# EAGLE design marklin 8-port bus connector (EAGLE 9.5.2)
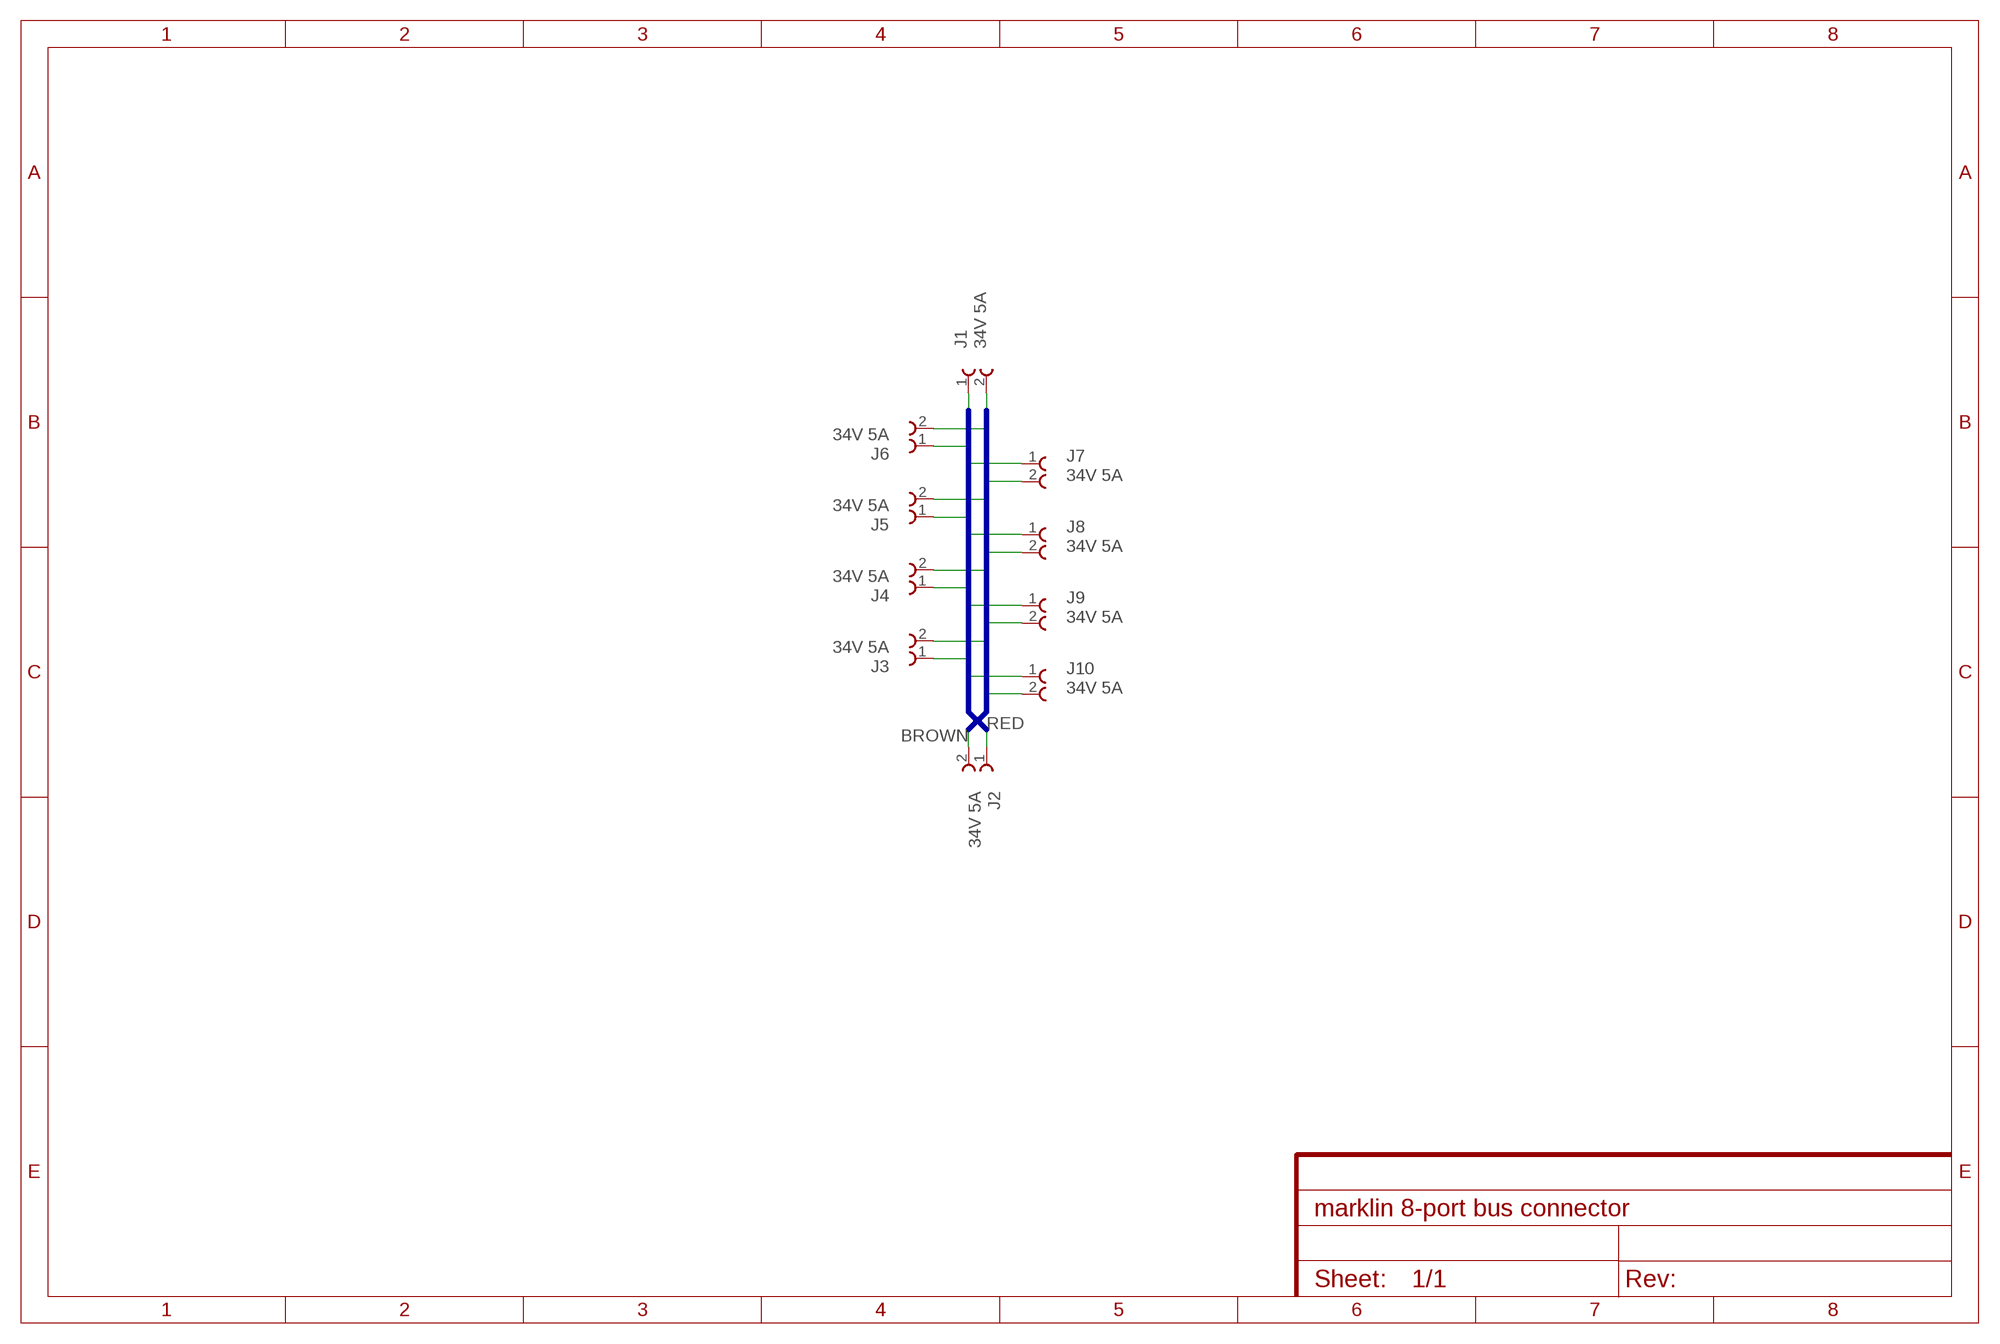
[diagram p0: schematic, sheet 1]

## Parts
J1  34V 5A  691111710002  [691111710002]
J2  34V 5A  691111710002  [691111710002]
J3  34V 5A  691111710002  [691111710002]
J4  34V 5A  691111710002  [691111710002]
J5  34V 5A  691111710002  [691111710002]
J6  34V 5A  691111710002  [691111710002]
J7  34V 5A  691111710002  [691111710002]
J8  34V 5A  691111710002  [691111710002]
J9  34V 5A  691111710002  [691111710002]
J10  34V 5A  691111710002  [691111710002]

## Nets
BROWN: J1.2 J2.2 J3.2 J4.2 J5.2 J6.2 J7.2 J8.2 J9.2 J10.2
RED: J1.1 J2.1 J3.1 J4.1 J5.1 J6.1 J7.1 J8.1 J9.1 J10.1

## Buses
RED
BROWN

## Library data of the parts
J1-J10 = Wurth_Elektronik_Electromechanic_Terminal_Blocks_Connectors_rev19d:691111710002: WR-TBL Serie 111 - 5.0mm Horizontal Entry Modular With Pressure Clamp - 2.0mm2 Wires, 2 Pins=>Code : Con_TBL_Screw_PressureClamp_691111710002 <http://katalog.we-online.de/media/images/eican/Con_TBL_Screw_PressureClamp_6911117100xx_pf2.jpg> Details see: http://katalog.we-online.de/en/em/691_111_710_0xx Created 2014-06-17, Karrer Zheng 2014 (C) Würth Elektronik; MF: WURTH ELEKTRONIK; MPN: 691111710002; OC_NEWARK: 19P1416

## Board
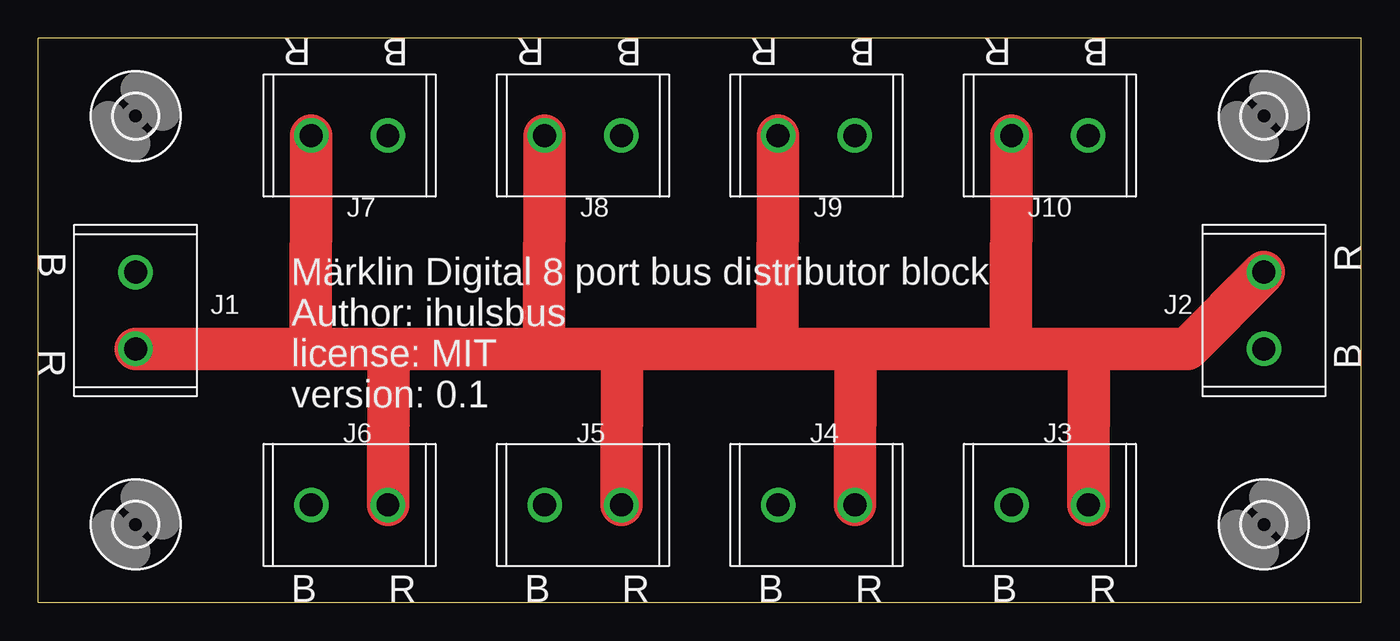
[diagram p1: board, top side]
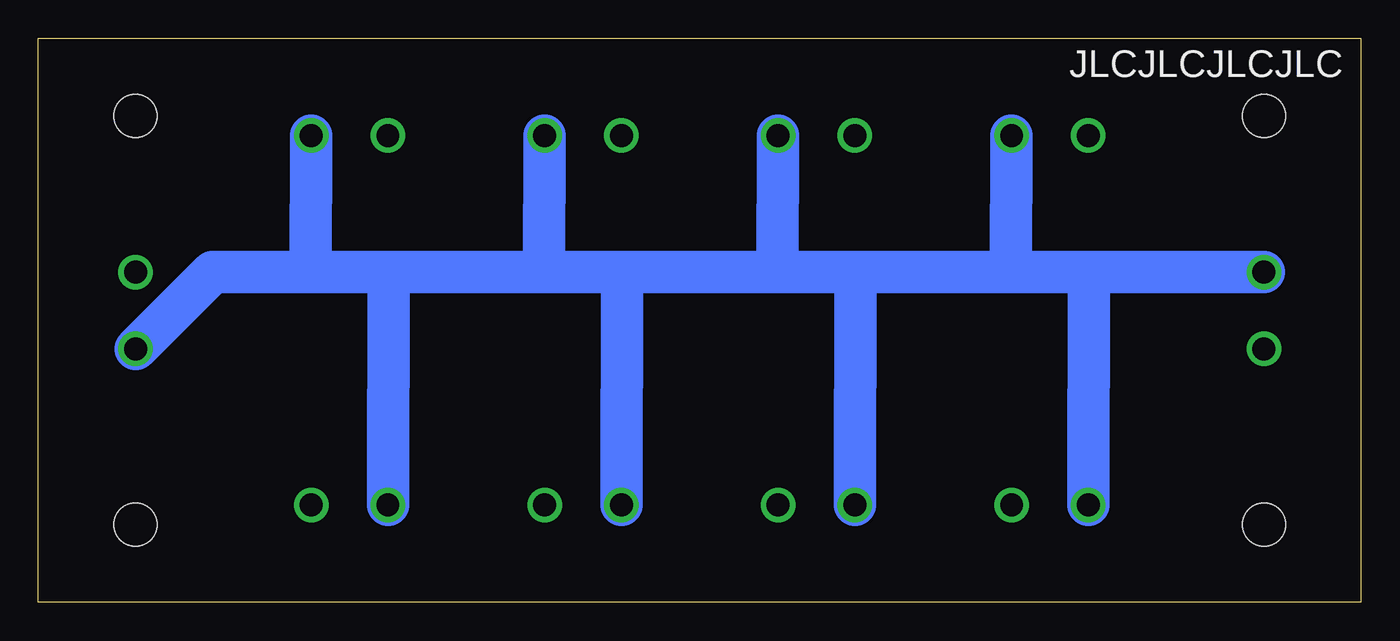
[diagram p2: board, bottom side, seen from below]

Size 86.36 x 36.83 mm. Coordinates in mm from the lower left corner, seen from the top.
Outline: 0,0 86.36,0 86.36,36.83 0,36.83 0,0
Copper layers (1*16): Top 0.035mm / dielectric 1.5mm / Bottom 0.035mm
Design rules "default": minimum track width 6mil, minimum drill 0.35mm, track to track 6mil, track to pad 6mil, pad to pad 6mil, via to via 6mil, smd to smd 6mil, copper to edge 40mil, drill to drill 6mil, minimum pad ring 10mil, minimum via ring 8mil, stop-mask expansion 4mil, vias tented up to drill 0mil, thermal gap 10mil

### Footprints (pad centres in the part's own frame; a part is rotated, then mirrored left to right if it is on the bottom)
691111710002 = drill 1.5: 1 -2.5,0; 2 2.5,0
2,8 = hole 2.8: 0,0

### Placement (x,y rotation side)
J1  6.35,19.05 90 top
J2  80.01,19.05 270 top
J3  66.04,6.35 180 top
J4  50.8,6.35 180 top
J5  35.56,6.35 180 top
J6  20.32,6.35 180 top
J7  20.32,30.48 0 top
J8  35.56,30.48 0 top
J9  50.8,30.48 0 top
J10  66.04,30.48 0 top
U$1  [2,8]  6.35,5.08 0 top
U$2  [2,8]  6.35,31.75 0 top
U$3  [2,8]  80.01,31.75 0 top
U$4  [2,8]  80.01,5.08 0 top

### Tracks (layer width: path | path; a pad name or v marks a point on that pad's centre or on a via)
BROWN
  Bottom 2.769: J1.2 17.78,21.55 | 17.78,21.55 22.86,21.55 | 22.86,21.55 33.02,21.55 | 33.02,21.55 38.1,21.55 | 38.1,21.55 48.26,21.55 | 48.26,21.55 53.34,21.55 | 53.34,21.55 63.5,21.55 | 63.5,21.55 68.58,21.55 | 68.58,21.55 74.97,21.55 J2.2 | J6.2 17.78,21.55 | J5.2 33.02,21.55 | J4.2 48.26,21.55 | J3.2 63.5,21.55 | J10.2 68.58,21.55 | J9.2 53.34,21.55 | J8.2 38.1,21.55 | J7.2 22.86,21.55
RED
  Top 2.769: J1.1 17.78,16.55 | 17.78,16.55 22.86,16.55 | 22.86,16.55 33.02,16.55 | 33.02,16.55 38.1,16.55 | 38.1,16.55 48.26,16.55 | 48.26,16.55 53.34,16.55 | 53.34,16.55 63.5,16.55 | 63.5,16.55 68.58,16.55 | 68.58,16.55 75.01,16.55 J2.1 | J6.1 22.86,16.55 | J5.1 38.1,16.55 | J4.1 53.34,16.55 | J3.1 68.58,16.55 | J10.1 63.5,16.55 | J9.1 48.26,16.55 | J8.1 33.02,16.55 | J7.1 17.78,16.55

### Text on the board
tPlace: R | B | R | B | R | B | R | B | B | R | R | B | Märklin Digital 8 port bus distributor block / Author: ihulsbus / license: MIT / version: 0.1 | B | R | B | R | B | R | B | R
bPlace: JLCJLCJLCJLC